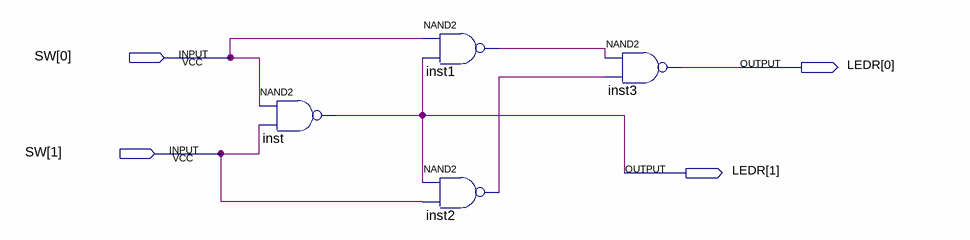
[diagram p0: schematic sheet]
// Quartus schematic half_adder.bdf as structural Verilog: 4 symbols, 4 pins
module half_adder (
  input  [1:0] SW,
  output [1:0] LEDR
);

  wire inst1_out, inst2_out;

  nand inst (LEDR[1], SW[0], SW[1]);
  nand inst1 (inst1_out, SW[0], LEDR[1]);
  nand inst2 (inst2_out, LEDR[1], SW[1]);
  nand inst3 (LEDR[0], inst1_out, inst2_out);
endmodule
